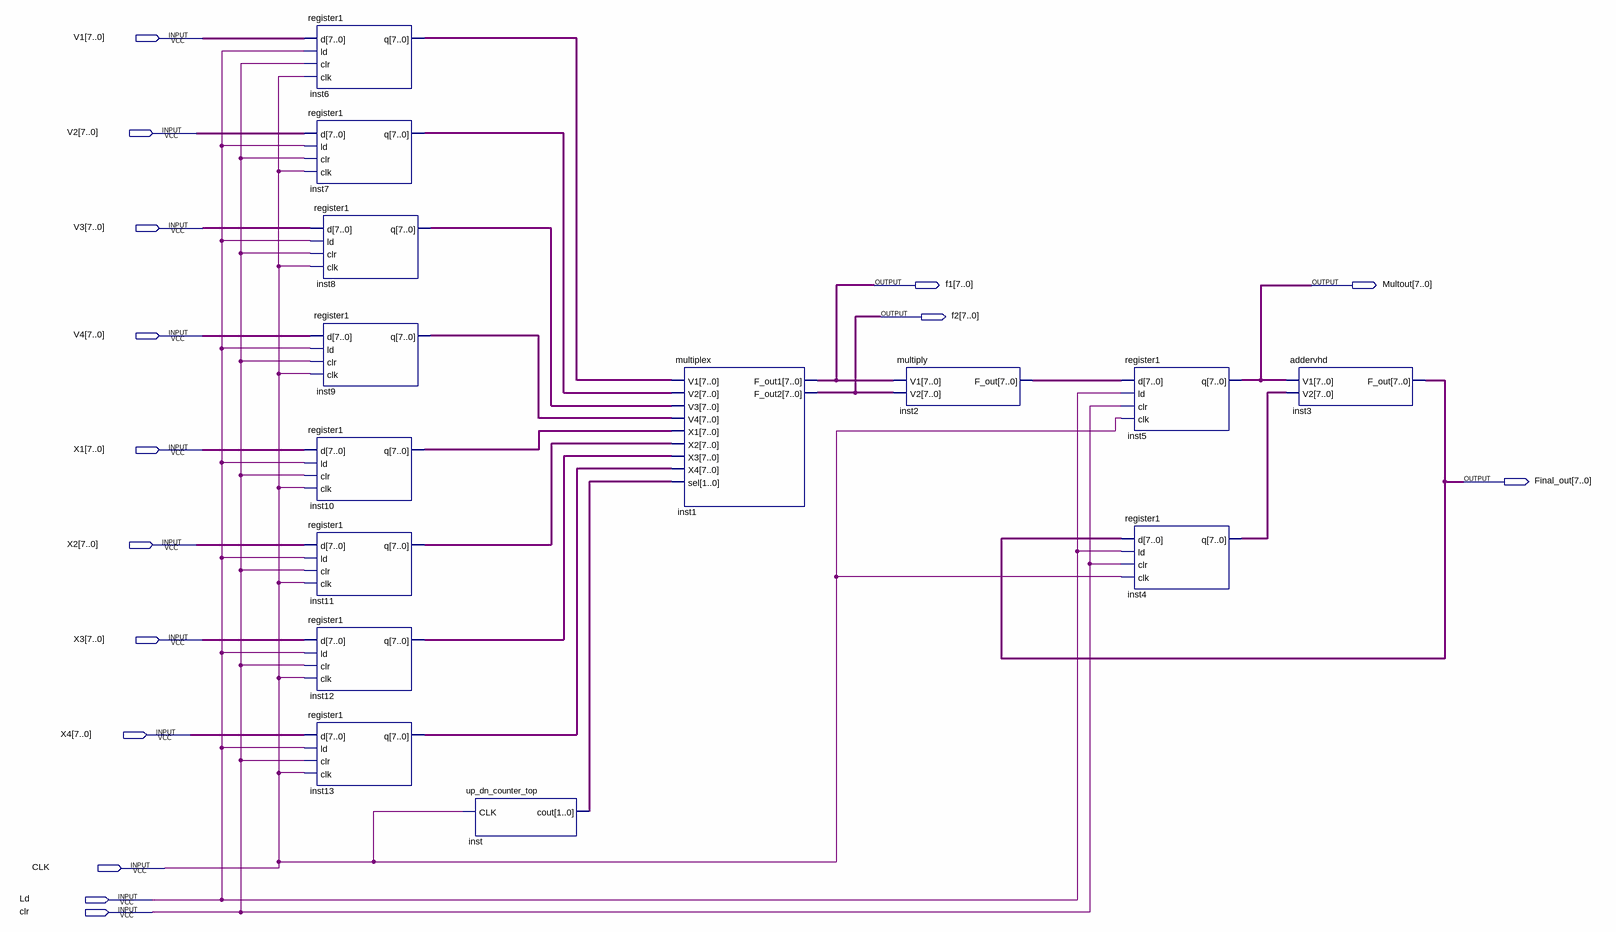
[diagram p0: schematic sheet]
// Quartus schematic datapath.bdf as structural Verilog: 14 symbols, 15 pins
module datapath (
  input  [7:0] V1,
  input  [7:0] V2,
  input  [7:0] V3,
  input  [7:0] V4,
  input  [7:0] X1,
  input  [7:0] X2,
  input  [7:0] X3,
  input  [7:0] X4,
  input  CLK,
  input  Ld,
  input  clr,
  output [7:0] f1,
  output [7:0] Multout,
  output [7:0] f2,
  output [7:0] Final_out
);

  wire [1:0] inst_cout;
  wire [7:0] inst2_f_out, inst4_q, inst6_q, inst7_q, inst8_q, inst9_q, inst10_q, inst11_q, inst12_q, inst13_q;

  register1 inst6 (.d(V1), .ld(Ld), .clr(clr), .clk(CLK), .q(inst6_q));
  register1 inst7 (.d(V2), .ld(Ld), .clr(clr), .clk(CLK), .q(inst7_q));
  register1 inst8 (.d(V3), .ld(Ld), .clr(clr), .clk(CLK), .q(inst8_q));
  register1 inst9 (.d(V4), .ld(Ld), .clr(clr), .clk(CLK), .q(inst9_q));
  register1 inst10 (.d(X1), .ld(Ld), .clr(clr), .clk(CLK), .q(inst10_q));
  register1 inst11 (.d(X2), .ld(Ld), .clr(clr), .clk(CLK), .q(inst11_q));
  register1 inst12 (.d(X3), .ld(Ld), .clr(clr), .clk(CLK), .q(inst12_q));
  register1 inst13 (.d(X4), .ld(Ld), .clr(clr), .clk(CLK), .q(inst13_q));
  up_dn_counter_top inst (.CLK(CLK), .cout(inst_cout));
  multiplex inst1 (
    .V1(inst6_q), .V2(inst7_q), .V3(inst8_q), .V4(inst9_q), .X1(inst10_q), .X2(inst11_q), .X3(inst12_q),
    .X4(inst13_q), .sel(inst_cout), .F_out1(f1), .F_out2(f2));
  multiply inst2 (.V1(f1), .V2(f2), .F_out(inst2_f_out));
  register1 inst5 (.d(inst2_f_out), .ld(Ld), .clr(clr), .clk(CLK), .q(Multout));
  register1 inst4 (.d(Final_out), .ld(Ld), .clr(clr), .clk(CLK), .q(inst4_q));
  addervhd inst3 (.V1(Multout), .V2(inst4_q), .F_out(Final_out));
endmodule
